# EAGLE design Arduino Shield (EAGLE 6.5.0)
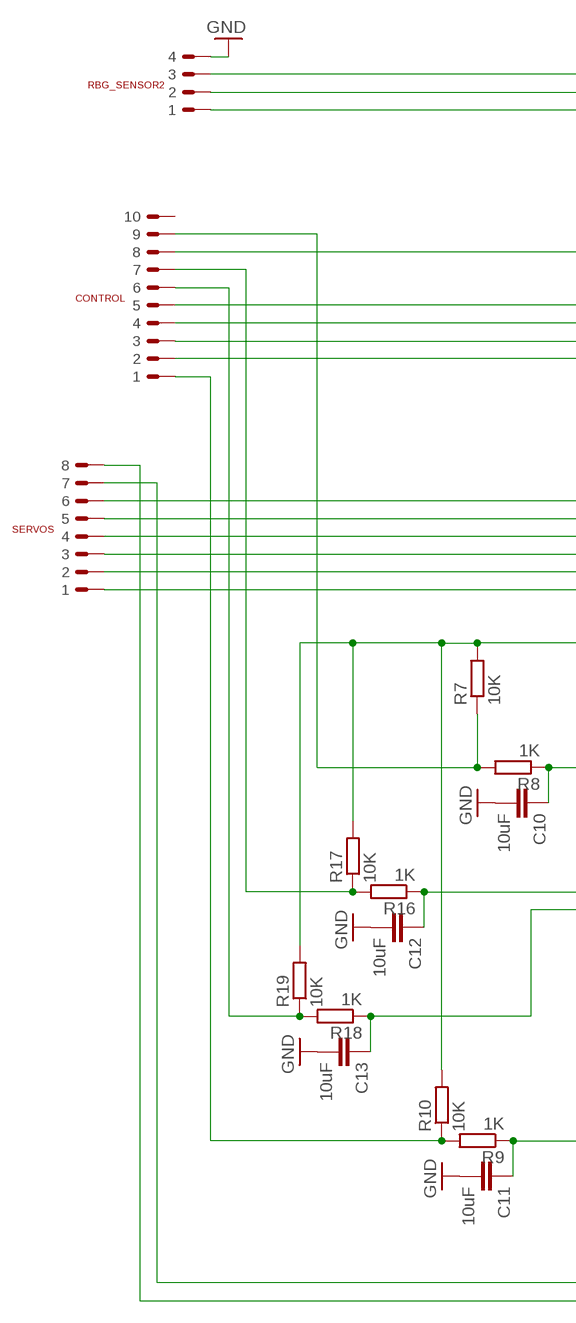
[diagram p0: schematic, sheet 1, part 1 of 2]
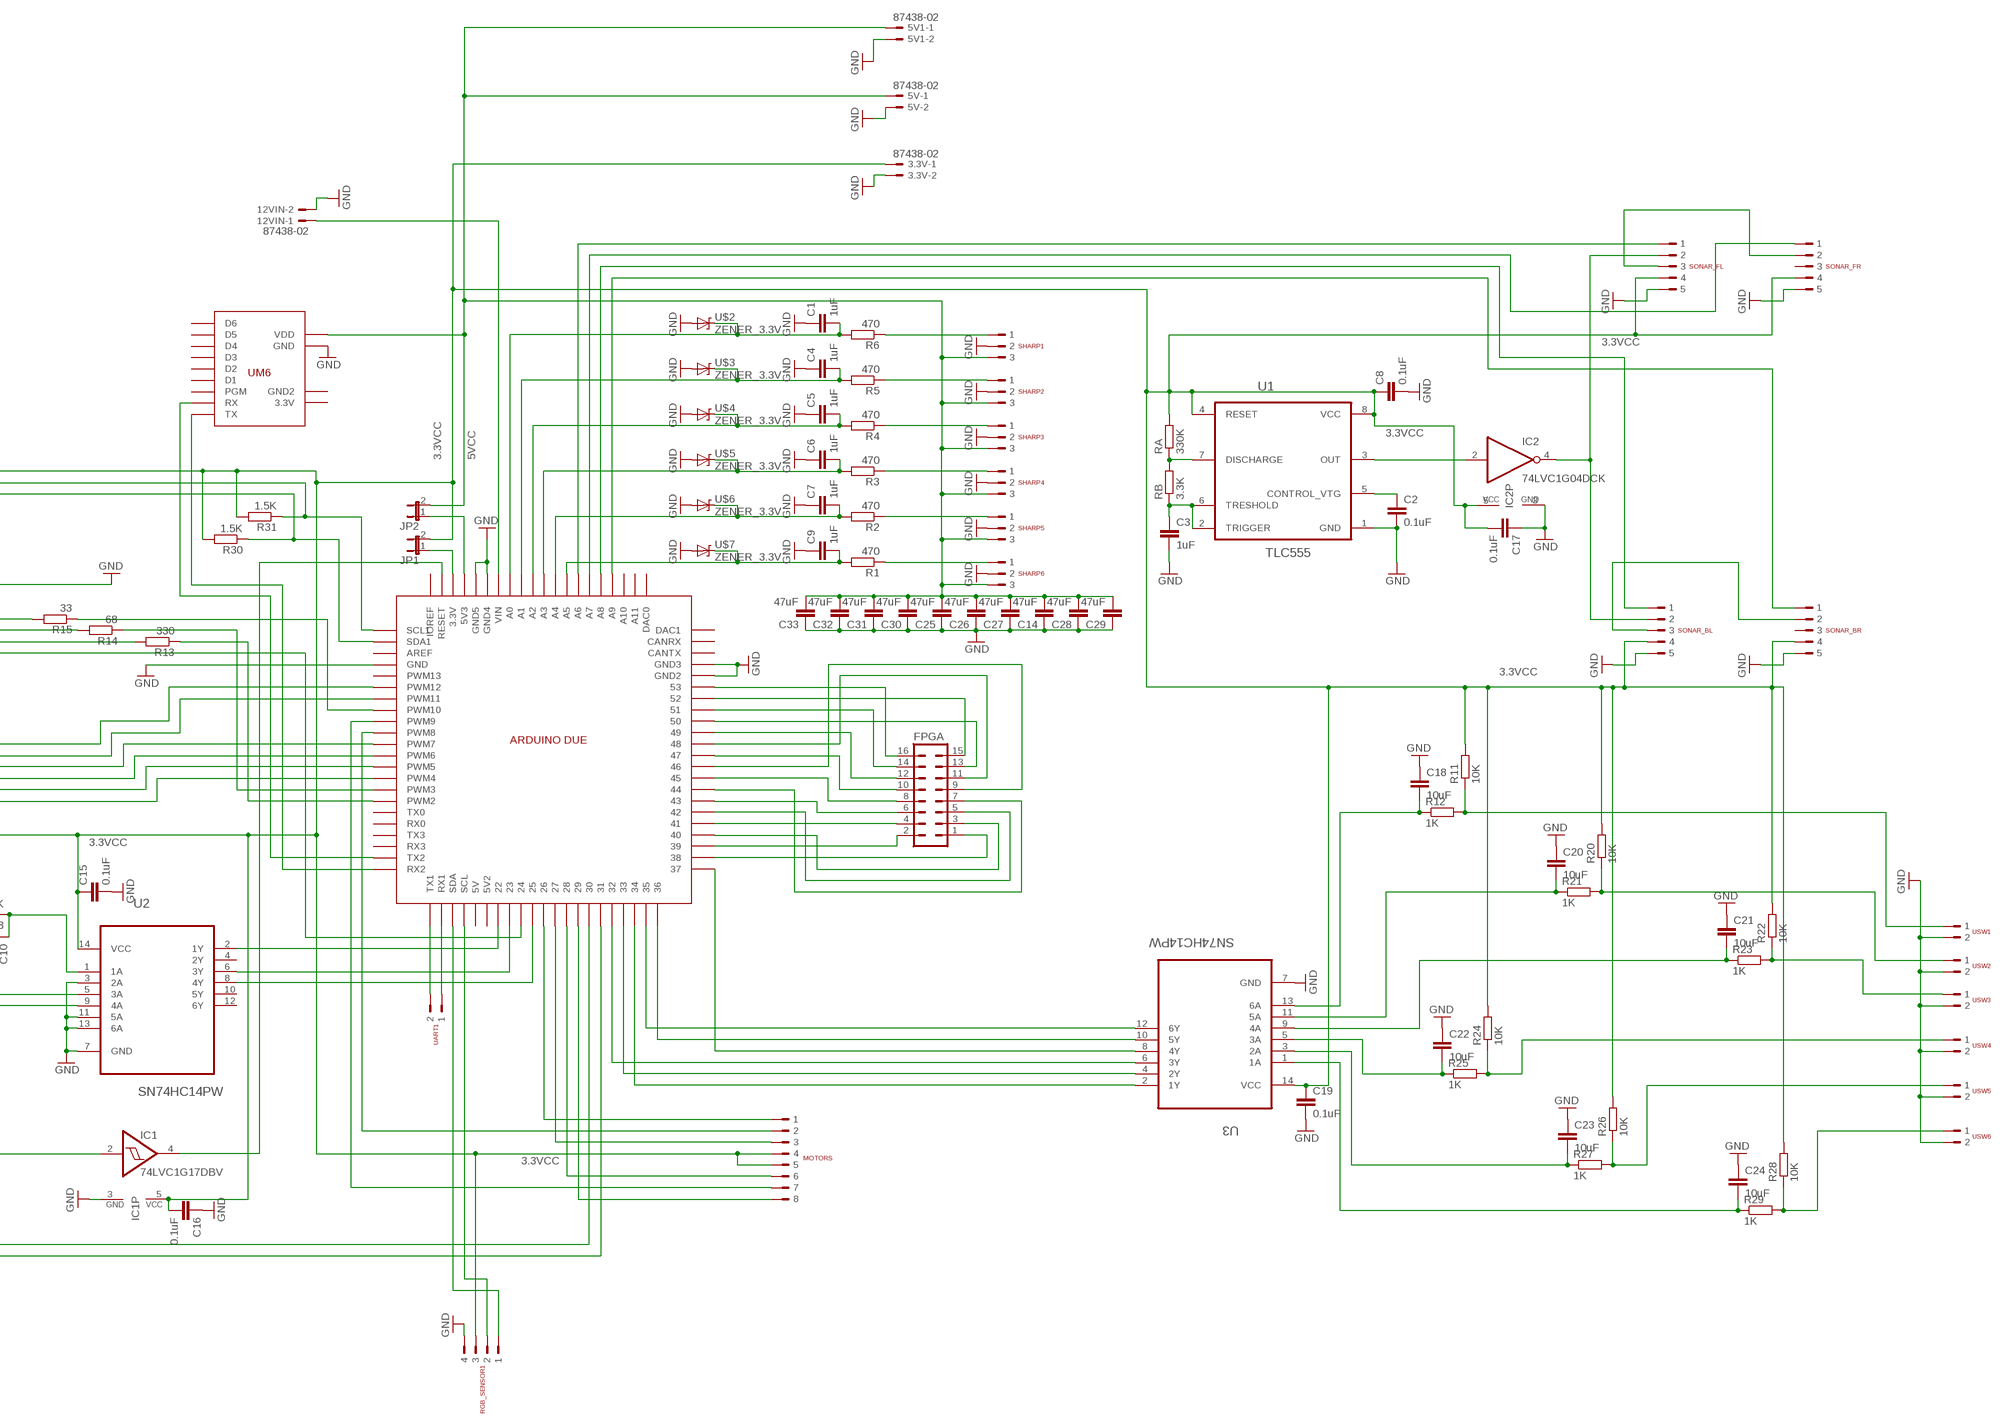
[diagram p1: schematic, sheet 1, part 2 of 2]

## Parts
3.3V  87438-02  [87438-02]
5V  87438-02  [87438-02]
5V1  87438-02  [87438-02]
12VIN  87438-02  [87438-02]
C1  1uF  C-EUC0603  [C0603]
C2  0.1uF  C-EUC0603  [C0603]
C3  1uF  C-EUC0603  [C0603]
C4  1uF  C-EUC0603  [C0603]
C5  1uF  C-EUC0603  [C0603]
C6  1uF  C-EUC0603  [C0603]
C7  1uF  C-EUC0603  [C0603]
C8  0.1uF  C-EUC0603  [C0603]
C9  1uF  C-EUC0603  [C0603]
C10  10uF  C-EUC0603  [C0603]
C11  10uF  C-EUC0603  [C0603]
C12  10uF  C-EUC0603  [C0603]
C13  10uF  C-EUC0603  [C0603]
C14  47uF  C-EUC1206  [C1206]
C15  0.1uF  C-EUC0603  [C0603]
C16  0.1uF  C-EUC0603  [C0603]
C17  0.1uF  C-EUC0603  [C0603]
C18  10uF  C-EUC0603  [C0603]
C19  0.1uF  C-EUC0603  [C0603]
C20  10uF  C-EUC0603  [C0603]
C21  10uF  C-EUC0603  [C0603]
C22  10uF  C-EUC0603  [C0603]
C23  10uF  C-EUC0603  [C0603]
C24  10uF  C-EUC0603  [C0603]
C25  47uF  C-EUC1206  [C1206]
C26  47uF  C-EUC1206  [C1206]
C27  47uF  C-EUC1206  [C1206]
C28  47uF  C-EUC1206  [C1206]
C29  47uF  C-EUC1206  [C1206]
C30  47uF  C-EUC1206  [C1206]
C31  47uF  C-EUC1206  [C1206]
C32  47uF  C-EUC1206  [C1206]
C33  47uF  C-EUC1206  [C1206]
CONTROL  87437-1043  [87437-1043]
FPGA  ML16  [ML16]
IC1  74LVC1G17DBV  [SOT23-5]
IC2  74LVC1G04DCK  [SC70-5]
JP1  JP1E  [JP1]
JP2  JP1E  [JP1]
MOTORS  87437-0843  [87437-0843]
R1  470  R-EU_R0603  [R0603]
R2  470  R-EU_R0603  [R0603]
R3  470  R-EU_R0603  [R0603]
R4  470  R-EU_R0603  [R0603]
R5  470  R-EU_R0603  [R0603]
R6  470  R-EU_R0603  [R0603]
R7  10K  R-EU_R0603  [R0603]
R8  1K  R-EU_R0603  [R0603]
R9  1K  R-EU_R0603  [R0603]
R10  10K  R-EU_R0603  [R0603]
R11  10K  R-EU_R0603  [R0603]
R12  1K  R-EU_R0603  [R0603]
R13  330  R-EU_R0603  [R0603]
R14  68  R-EU_R0603  [R0603]
R15  33  R-EU_R0603  [R0603]
R16  1K  R-EU_R0603  [R0603]
R17  10K  R-EU_R0603  [R0603]
R18  1K  R-EU_R0603  [R0603]
R19  10K  R-EU_R0603  [R0603]
R20  10K  R-EU_R0603  [R0603]
R21  1K  R-EU_R0603  [R0603]
R22  10K  R-EU_R0603  [R0603]
R23  1K  R-EU_R0603  [R0603]
R24  10K  R-EU_R0603  [R0603]
R25  1K  R-EU_R0603  [R0603]
R26  10K  R-EU_R0603  [R0603]
R27  1K  R-EU_R0603  [R0603]
R28  10K  R-EU_R0603  [R0603]
R29  1K  R-EU_R0603  [R0603]
R30  1.5K  R-EU_R0603  [R0603]
R31  1.5K  R-EU_R0603  [R0603]
RA  330K  R-EU_R0603  [R0603]
RB  3.3K  R-EU_R0603  [R0603]
RBG_SENSOR2  87437-0443  [87437-0443]
RGB_SENSOR1  87437-0443  [87437-0443]
SERVOS  87437-0843  [87437-0843]
SHARP1  87437-0343  [87437-0343]
SHARP2  87437-0343  [87437-0343]
SHARP3  87437-0343  [87437-0343]
SHARP4  87437-0343  [87437-0343]
SHARP5  87437-0343  [87437-0343]
SHARP6  87437-0343  [87437-0343]
SONAR_BL  87437-0543  [87437-0543]
SONAR_BR  87437-0543  [87437-0543]
SONAR_FL  87437-0543  [87437-0543]
SONAR_FR  87437-0543  [87437-0543]
U1  TLC555  LM555CM  [SOIC127P600X175-8N]
U2  SN74HC14PW  [SOP65P640X120-14N]
U3  SN74HC14PW  [SOP65P640X120-14N]
U$1  ARDUINO-DUE  [ARDUINO-DUE]
U$2  ZENER_3.3V  DIODE-ZENER-BZT52  [SOD-323]
U$3  ZENER_3.3V  DIODE-ZENER-BZT52  [SOD-323]
U$4  ZENER_3.3V  DIODE-ZENER-BZT52  [SOD-323]
U$5  ZENER_3.3V  DIODE-ZENER-BZT52  [SOD-323]
U$6  ZENER_3.3V  DIODE-ZENER-BZT52  [SOD-323]
U$7  ZENER_3.3V  DIODE-ZENER-BZT52  [SOD-323]
UART1  87437-0243  [87437-0243]
UM6  UM6  [UM6]
USW1  87437-0243  [87437-0243]
USW2  87437-0243  [87437-0243]
USW3  87437-0243  [87437-0243]
USW4  87437-0243  [87437-0243]
USW5  87437-0243  [87437-0243]
USW6  87437-0243  [87437-0243]

## Nets
3.3VCC: 3.3V.1 C8.1 C15.1 C16.2 C17.2 C19.1 IC1.5(VCC) IC2.5(VCC) JP1.2 MOTORS.P$4 MOTORS.P$5 R7.2 R10.2 R11.2 R17.2 R19.2 R20.2 R22.2 R24.2 R26.2 R28.2 R30.2 R31.2 RA.2 RBG_SENSOR2.P$3 RGB_SENSOR1.P$3 SONAR_BL.P$4 SONAR_BR.P$4 SONAR_FL.P$4 SONAR_FR.P$4 U1.4(RESET) U1.8(VCC) U2.14(VCC) U3.14(VCC)
5VCC: 5V1.1 5V.1 C14.2 C25.2 C26.2 C27.2 C28.2 C29.2 C30.2 C31.2 C32.2 C33.2 JP2.2 SHARP1.P$3 SHARP2.P$3 SHARP3.P$3 SHARP4.P$3 SHARP5.P$3 SHARP6.P$3 UM6.P$10(VDD)
12VIN: 12VIN.1 U$1.VIN
BLUE: R15.1 U$1.PWM10
BTN1: U2.6(3Y) U$1.23
BTN2: U2.8(4Y) U$1.25
BUT1: CONTROL.P$7 R16.2 R17.1
BUT2: CONTROL.P$6 R18.2 R19.1
COLOR: CONTROL.P$2 U$1.24
GND: 3.3V.2 5V1.2 5V.2 12VIN.2 C1.1 C2.2 C3.2 C4.1 C5.1 C6.1 C7.1 C8.2 C9.1 C10.2 C11.2 C12.2 C13.2 C14.1 C15.2 C16.1 C17.1 C18.1 C19.2 C20.1 C21.1 C22.1 C23.1 C24.1 C25.1 C26.1 C27.1 C28.1 C29.1 C30.1 C31.1 C32.1 C33.1 CONTROL.P$8 IC1.3(GND) IC2.3(GND) RBG_SENSOR2.P$4 RGB_SENSOR1.P$4 SHARP1.P$2 SHARP2.P$2 SHARP3.P$2 SHARP4.P$2 SHARP5.P$2 SHARP6.P$2 SONAR_BL.P$5 SONAR_BR.P$5 SONAR_FL.P$5 SONAR_FR.P$5 U1.1(GND) U2.3(2A) U2.7(GND) U2.11(5A) U2.13(6A) U3.7(GND) U$1.GND U$1.GND2 U$1.GND3 U$1.GND4 U$1.GND5 U$2.2(A) U$3.2(A) U$4.2(A) U$5.2(A) U$6.2(A) U$7.2(A) UM6.P$11(GND) USW1.P$2 USW2.P$2 USW3.P$2 USW4.P$2 USW5.P$2 USW6.P$2
GREEN: R14.1 U$1.PWM3
JACK: U2.2(1Y) U$1.22
MOTOR1_BREAK: MOTORS.P$6 U$1.28
MOTOR1_DIR: MOTORS.P$7 U$1.PWM9
MOTOR1_PWM: MOTORS.P$8 U$1.29
MOTOR2_BREAK: MOTORS.P$1 U$1.26
MOTOR2_DIR: MOTORS.P$2 U$1.PWM8
MOTOR2_PWM: MOTORS.P$3 U$1.27
N$1: JP1.1 U$1.3.3V
N$2: C12.1 R16.1 U2.5(3A)
N$3: SERVOS.P$1 U$1.PWM4
N$4: SERVOS.P$2 U$1.PWM5
N$5: SERVOS.P$3 U$1.PWM6
N$6: SERVOS.P$4 U$1.PWM7
N$7: IC1.4(O) U$1.RESET
N$8: JP2.1 U$1.5V3
N$9: R11.1 R12.2 USW1.P$1
N$10: C18.2 R12.1 U3.13(6A)
N$11: C13.1 R18.1 U2.9(4A)
N$12: SERVOS.P$5 U$1.PWM11
N$13: SERVOS.P$6 U$1.PWM12
N$14: SERVOS.P$7 U$1.30
N$15: CONTROL.P$5 R15.2
N$16: CONTROL.P$4 R14.2
N$17: CONTROL.P$3 R13.2
N$18: SERVOS.P$8 U$1.31
N$19: R20.1 R21.2 USW2.P$1
N$20: C20.2 R21.1 U3.11(5A)
N$21: R22.1 R23.2 USW3.P$1
N$22: C21.2 R23.1 U3.9(4A)
N$23: R24.1 R25.2 USW4.P$1
N$24: C22.2 R25.1 U3.5(3A)
N$25: R26.1 R27.2 USW5.P$1
N$26: C23.2 R27.1 U3.3(2A)
N$27: CONTROL.P$9 R7.1 R8.2
N$28: R28.1 R29.2 USW6.P$1
N$29: C24.2 R29.1 U3.1(1A)
N$33: C3.1 RB.1 U1.2(TRIGGER) U1.6(TRESHOLD)
N$34: C2.1 U1.5(CONTROL_VTG)
N$35: RA.1 RB.2 U1.7(DISCHARGE)
N$36: IC2.2(I) U1.3(OUT)
N$39: SONAR_FL.P$3 SONAR_FR.P$2
N$40: SONAR_BL.P$3 SONAR_BR.P$2
N$44: FPGA.1 U$1.38
N$45: IC2.4(O) SONAR_BL.P$2 SONAR_FL.P$2
N$47: FPGA.2 U$1.39
N$48: FPGA.3 U$1.40
N$49: FPGA.4 U$1.41
N$50: FPGA.5 U$1.42
N$51: FPGA.6 U$1.43
N$52: FPGA.7 U$1.44
N$53: FPGA.8 U$1.45
N$54: FPGA.9 U$1.46
N$55: FPGA.10 U$1.47
N$56: FPGA.11 U$1.48
N$57: FPGA.12 U$1.49
N$58: FPGA.13 U$1.50
N$59: FPGA.14 U$1.51
N$60: FPGA.15 U$1.52
N$61: FPGA.16 U$1.53
N$62: R5.1 SHARP2.P$1
N$63: R4.1 SHARP3.P$1
N$64: R3.1 SHARP4.P$1
N$65: R2.1 SHARP5.P$1
N$66: R1.1 SHARP6.P$1
N$67: C10.1 R8.1 U2.1(1A)
N$69: R6.1 SHARP1.P$1
N$71: C11.1 IC1.2(I) R9.1
RED: R13.1 U$1.PWM2
RST: CONTROL.P$1 R9.2 R10.1
RX1: U$1.RX1 UART1.P$1
SCL: RGB_SENSOR1.P$2 U$1.SCL
SCL1: R31.1 RBG_SENSOR2.P$2 U$1.SCL1
SDA: RGB_SENSOR1.P$1 U$1.SDA
SDA1: R30.1 RBG_SENSOR2.P$1 U$1.SDA1
SHARP1: C1.2 R6.2 U$1.A0 U$2.1(C)
SHARP2: C4.2 R5.2 U$1.A1 U$3.1(C)
SHARP3: C5.2 R4.2 U$1.A2 U$4.1(C)
SHARP4: C6.2 R3.2 U$1.A3 U$5.1(C)
SHARP5: C7.2 R2.2 U$1.A4 U$6.1(C)
SHARP6: C9.2 R1.2 U$1.A5 U$7.1(C)
SONAR_BL: SONAR_BL.P$1 U$1.A8
SONAR_BR: SONAR_BR.P$1 U$1.A9
SONAR_FL: SONAR_FL.P$1 U$1.A6
SONAR_FR: SONAR_FR.P$1 U$1.A7
TX1: U$1.TX1 UART1.P$2
UM6_RX: U$1.TX2 UM6.P$2(RX)
UM6_TX: U$1.RX2 UM6.P$1(TX)
USW1: U3.2(1Y) U$1.34
USW2: U3.4(2Y) U$1.33
USW3: U3.6(3Y) U$1.32
USW4: U3.8(4Y) U$1.37
USW5: U3.10(5Y) U$1.36
USW6: U3.12(6Y) U$1.35
Unconnected: CONTROL.P$10 SONAR_BR.P$3 SONAR_FR.P$3 U2.4(2Y) U2.10(5Y) U2.12(6Y) U$1.5V U$1.5V2 U$1.A10 U$1.A11 U$1.AREF U$1.CANRX U$1.CANTX U$1.DAC0 U$1.DAC1 U$1.IOREF U$1.PWM13 U$1.RX0 U$1.RX3 U$1.TX0 U$1.TX3 UM6.P$3(PGM) UM6.P$4(D1) UM6.P$5(D2) UM6.P$6(D3) UM6.P$7(D4) UM6.P$8(D5) UM6.P$9(D6) UM6.P$12(GND2) UM6.P$13(3.3V)

## Library data of the parts
3.3V 5V 5V1 12VIN = con-molex:87438-02: Wire-to-Board 1.50mm (.059") Pitch Header - Right Angle, SMT, Shrouded Source: http://www.molex.com/product/micro/87438.html; OC_FARNELL: 1711327; OC_NEWARK: unknown
C1-C33 = rcl:C-EU: CAPACITOR, European symbol
CONTROL = custom:87437-1043
FPGA = con-harting-ml:ML16: HARTING; OC_FARNELL: unknown; OC_NEWARK: unknown
IC1 = 74xx-little-de:74*1G17: Single Schmitt-Trigger Buffer
IC2 = 74xx-little-us:74*1G04: INVERTER Gate
JP1 JP2 = jumper:JP1E: JUMPER
MOTORS SERVOS = custom:87437-0843
R1-R31 RA RB = rcl:R-EU_: RESISTOR, European symbol
RBG_SENSOR2 RGB_SENSOR1 = custom:87437-0443
SHARP1-SHARP6 = custom:87437-0343
SONAR_BL SONAR_BR SONAR_FL SONAR_FR = custom:87437-0543
U1 = custom:LM555CM: Single Timer; MPN: LM555CM; OC_FARNELL: 9488227; OC_NEWARK: 78K6011; PACKAGE: SOIC-8; SUPPLIER: LM555CM
U2 U3 = custom:SN74HC14PW: HEX SCHMITT-TRIGGER INVERTERS; MPN: SN74HC14PW; OC_FARNELL: 9591133; OC_NEWARK: 02H5414; PACKAGE: TSSOP-14; SUPPLIER: Texas Instruments
U$1 = custom:ARDUINO-DUE
U$2-U$7 = SparkFun:DIODE-ZENER: Zener Diode Production Part - 8199 3.4V Zener Voltage
UART1 USW1-USW6 = custom:87437-0243
UM6 = custom:UM6

## Board
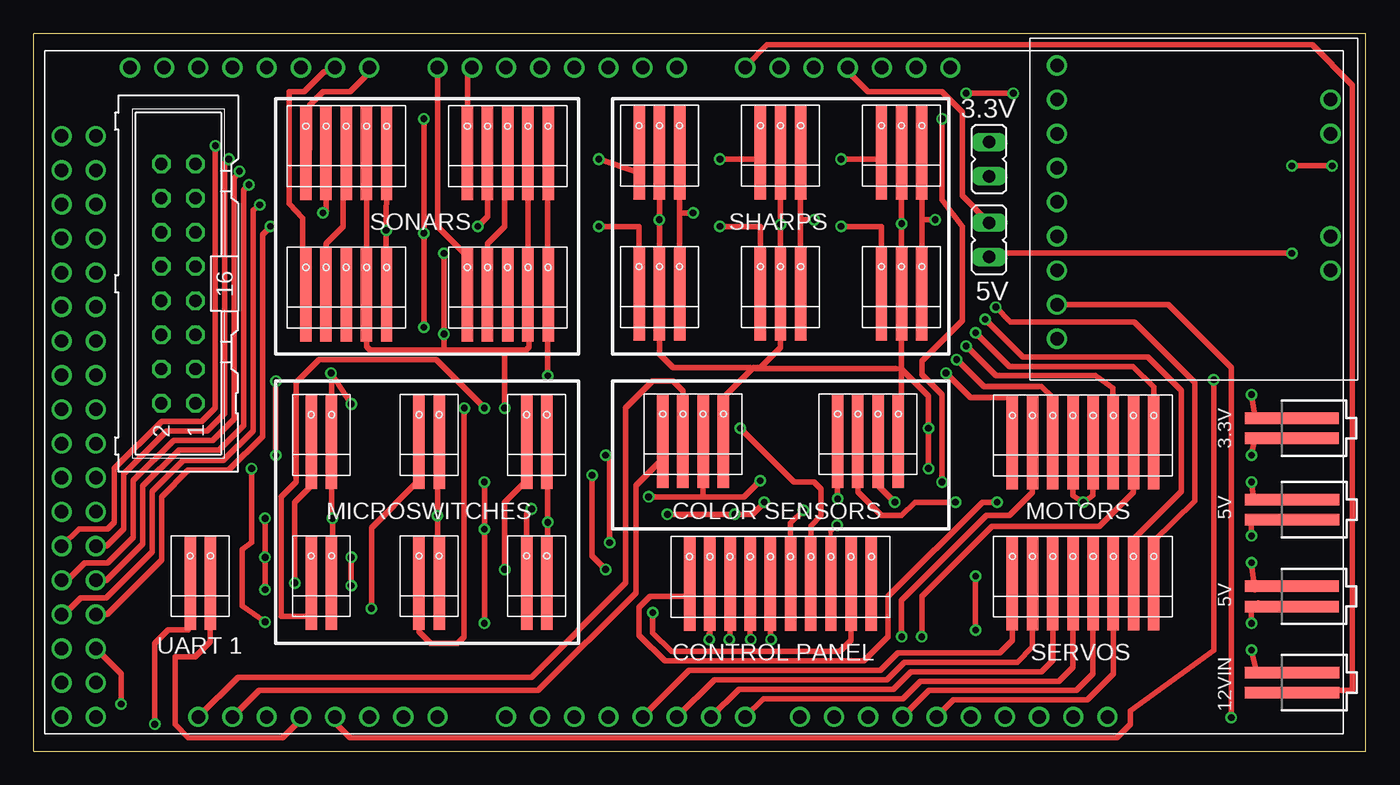
[diagram p2: board, top side]
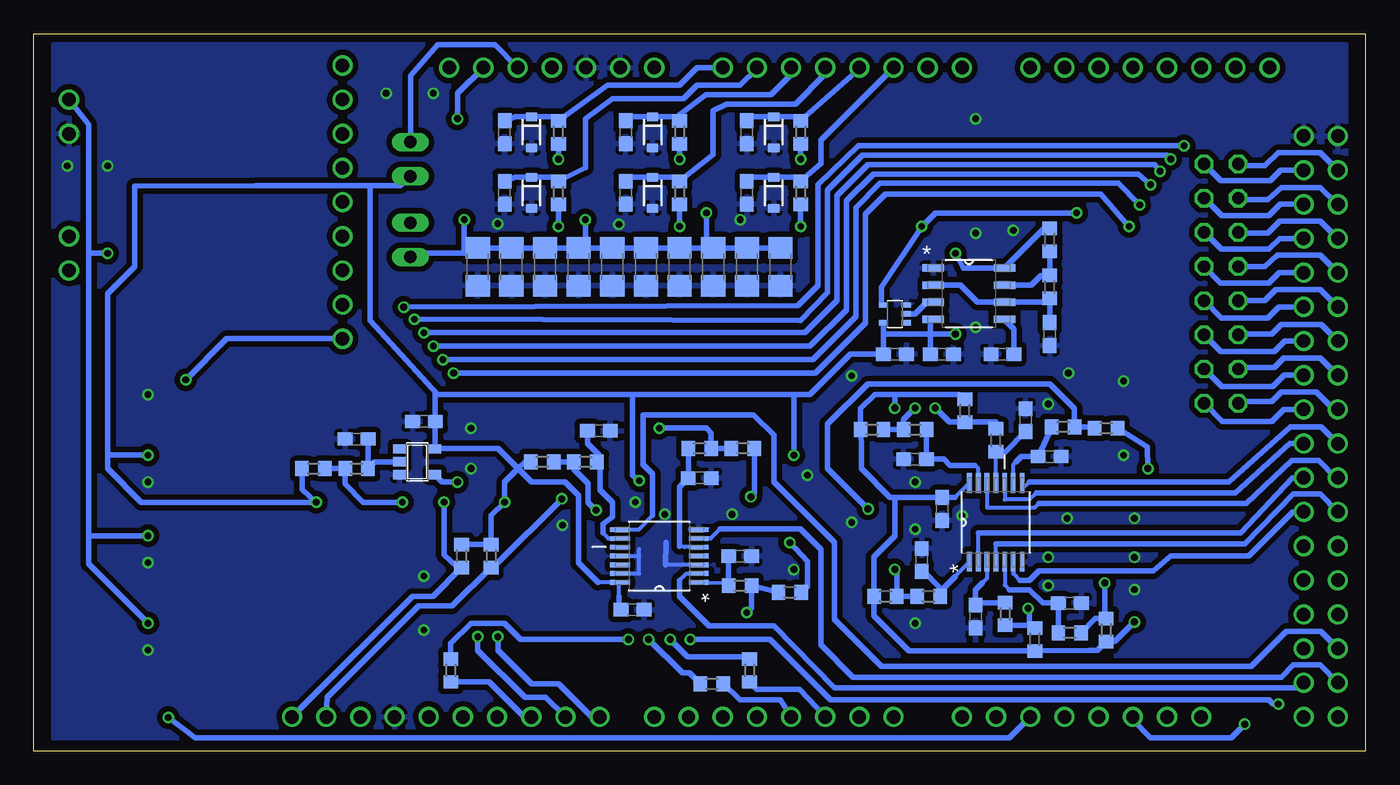
[diagram p3: board, bottom side, seen from below]

Size 99 x 53.33 mm. Coordinates in mm from the lower left corner, seen from the top.
Outline: 0,0 99,0 99,53.33 0,53.33 0,0
Copper layers (1*16): Top 0.0356mm / dielectric 1.5011mm / Bottom 0.0356mm
Design rules "Custom *": minimum track width 12mil, minimum drill 19mil, track to track 10mil, track to pad 8mil, pad to pad 9mil, via to via 10mil, smd to smd 6mil, copper to edge 16mil, drill to drill 16mil, minimum pad ring 7mil, minimum via ring 7mil, stop-mask expansion 4mil, vias tented up to drill 0mil, thermal gap 10mil

### Footprints (pad centres in the part's own frame; a part is rotated, then mirrored left to right if it is on the bottom)
87438-02 = smd 7 x 0.85: 1 0,0.75; 2 0,-0.75
C0603 = smd 1.1 x 1: 1 -0.85,0; 2 0.85,0
C1206 = smd 1.6 x 1.8: 1 -1.4,0; 2 1.4,0
87437-1043 = smd 7 x 0.85: P$1 -0.05,6.75; P$2 -0.05,5.25; P$3 -0.05,3.75; P$4 -0.05,2.25; P$5 -0.05,0.75; P$6 -0.05,-0.75; P$7 -0.05,-2.25; P$8 -0.05,-3.75; P$9 -0.05,-5.25; P$10 -0.05,-6.75
ML16 = drill 0.914 octagon: 1 -8.89,-1.27; 2 -8.89,1.27; 3 -6.35,-1.27; 4 -6.35,1.27; 5 -3.81,-1.27; 6 -3.81,1.27; 7 -1.27,-1.27; 8 -1.27,1.27; 9 1.27,-1.27; 10 1.27,1.27; 11 3.81,-1.27; 12 3.81,1.27; 13 6.35,-1.27; 14 6.35,1.27; 15 8.89,-1.27; 16 8.89,1.27
SOT23-5 = smd 0.69 x 0.99: 1 -0.95,-1.29; 2 0,-1.29; 3 0.95,-1.29; 4 0.95,1.3; 5 -0.95,1.3
SC70-5 = smd 0.4 x 0.7: 1 -0.65,-0.85; 2 0,-0.85; 3 0.65,-0.85; 4 0.65,0.85; 5 -0.65,0.85
JP1 = drill 0.914 long: 1 0,-1.27; 2 0,1.27
87437-0843 = smd 7 x 0.85: P$1 -0.04,5.27; P$2 -0.04,3.77; P$3 -0.04,2.27; P$4 -0.04,0.77; P$5 -0.04,-0.73; P$6 -0.04,-2.23; P$7 -0.04,-3.73; P$8 -0.04,-5.23
R0603 = smd 1 x 1.1: 1 -0.85,0; 2 0.85,0
87437-0443 = smd 7 x 0.85: P$1 0.05,2.25; P$2 0.05,0.75; P$3 0.05,-0.75; P$4 0.05,-2.25
87437-0343 = smd 7 x 0.85: P$1 0,1.5; P$2 0,0; P$3 0,-1.5
87437-0543 = smd 7 x 0.85: P$1 -0.04,2.77; P$2 -0.04,1.27; P$3 -0.04,-0.23; P$4 -0.04,-1.73; P$5 -0.04,-3.23
SOIC127P600X175-8N = smd 1.6 x 0.559: 1 -2.642,1.905; 2 -2.642,0.635; 3 -2.642,-0.635; 4 -2.642,-1.905; 5 2.642,-1.905; 6 2.642,-0.635; 7 2.642,0.635; 8 2.642,1.905
SOP65P640X120-14N = smd 1.473 x 0.356: 1 -2.921,1.956; 2 -2.921,1.295; 3 -2.921,0.66; 4 -2.921,0; 5 -2.921,-0.66; 6 -2.921,-1.295; 7 -2.921,-1.956; 8 2.921,-1.956; 9 2.921,-1.295; 10 2.921,-0.66; 11 2.921,0; 12 2.921,0.66; 13 2.921,1.295; 14 2.921,1.956
ARDUINO-DUE = drill 1: 3.3V -17.78,-25.4; 5V 40.64,22.86; 5V2 43.18,22.86; 5V3 -15.24,-25.4; 22 40.64,20.32; 23 43.18,20.32; 24 40.64,17.78; 25 43.18,17.78; 26 40.64,15.24; 27 43.18,15.24; 28 40.64,12.7; 29 43.18,12.7; 30 40.64,10.16; 31 43.18,10.16; 32 40.64,7.62; 33 43.18,7.62; 34 40.64,5.08; 35 43.18,5.08; 36 40.64,2.54; 37 43.18,2.54; 38 40.64,0; 39 43.18,0; 40 40.64,-2.54; 41 43.18,-2.54; 42 40.64,-5.08; 43 43.18,-5.08; 44 40.64,-7.62; 45 43.18,-7.62; 46 40.64,-10.16; 47 43.18,-10.16; 48 40.64,-12.7; 49 43.18,-12.7; 50 40.64,-15.24; 51 43.18,-15.24; 52 40.64,-17.78; 53 43.18,-17.78; A0 -2.54,-25.4; A1 0,-25.4; A2 2.54,-25.4; A3 5.08,-25.4; A4 7.62,-25.4; A5 10.16,-25.4; A6 12.7,-25.4; A7 15.24,-25.4; A8 20.32,-25.4; A9 22.86,-25.4; A10 25.4,-25.4; A11 27.94,-25.4; AREF -29.464,22.86; CANRX 35.56,-25.4; CANTX 38.1,-25.4; DAC0 30.48,-25.4; DAC1 33.02,-25.4; GND -26.924,22.86; GND2 40.64,-20.32; GND3 43.18,-20.32; GND4 -10.16,-25.4; GND5 -12.7,-25.4; IOREF -22.86,-25.4; PWM2 5.08,22.86; PWM3 2.54,22.86; PWM4 0,22.86; PWM5 -2.54,22.86; PWM6 -5.08,22.86; PWM7 -7.62,22.86; PWM8 -11.684,22.86; PWM9 -14.224,22.86; PWM10 -16.764,22.86; PWM11 -19.304,22.86; PWM12 -21.844,22.86; PWM13 -24.384,22.86; RESET -20.32,-25.4; RX0 10.16,22.86; RX1 27.94,22.86; RX2 22.86,22.86; RX3 17.78,22.86; SCL 33.02,22.86; SCL1 -34.544,22.86; SDA 30.48,22.86; SDA1 -32.004,22.86; TX0 7.62,22.86; TX1 25.4,22.86; TX2 20.32,22.86; TX3 15.24,22.86; VIN -7.62,-25.4
SOD-323 = smd 0.63 x 0.83: 1 -1.15,0; 2 1.15,0
87437-0243 = smd 7 x 0.85: P$1 0,0.865; P$2 0,-0.635
UM6 = drill 1: P$1 9.652,9.652; P$2 9.652,7.112; P$3 9.652,4.572; P$4 9.652,2.032; P$5 9.652,-0.508; P$6 9.652,-3.048; P$7 9.652,-5.588; P$8 9.652,-8.128; P$9 9.652,-10.668; P$10 -10.668,-8.128; P$11 -10.668,-5.588; P$12 -10.668,2.032; P$13 -10.668,4.572

### Placement (x,y rotation side)
3.3V  93.5,24 180 top
5V  93.52,17.94 180 top
5V1  93.5,11.5 180 top
12VIN  93.52,5.09 180 top
C1  64,46 90 bottom
C2  27,29.5 180 bottom
C3  23.5,31 270 bottom
C4  64,41.5 90 bottom
C5  55,46 90 bottom
C6  55,41.5 90 bottom
C7  46,46 90 bottom
C8  31.5,29.5 0 bottom
C9  46,41.5 90 bottom
C10  46.5,14.5 0 bottom
C11  75,23.2 180 bottom
C12  49.5,20.3 0 bottom
C13  57,23.8 0 bottom
C14  53.5,36 90 bottom
C15  54.5,10.5 0 bottom
C16  70,24.5 0 bottom
C17  35,29.5 180 bottom
C18  33.5,21.7 0 bottom
C19  31.5,18 270 bottom
C20  25.3,24.6 270 bottom
C21  23.5,21.9 180 bottom
C22  22,11 180 bottom
C23  29,10 90 bottom
C24  33,14.2 270 bottom
C25  46,36 90 bottom
C26  51,36 90 bottom
C27  48.5,36 90 bottom
C28  56,36 90 bottom
C29  58.5,36 90 bottom
C30  61,36 90 bottom
C31  63.5,36 90 bottom
C32  66,36 90 bottom
C33  43.5,36 90 bottom
CONTROL  55.5,12.5 90 top
FPGA  10.75,34.75 90 top
IC1  70.5,21.5 270 bottom
IC2  35,32.5 90 bottom
JP1  71,44 180 top
JP2  71,38 180 top
MOTORS  78,23 90 top
R1  42,41.5 90 bottom
R2  42,46 90 bottom
R3  51,41.5 90 bottom
R4  51,46 90 bottom
R5  60,41.5 90 bottom
R6  60,46 90 bottom
R7  42.8,11.8 0 bottom
R8  46.5,12.3 0 bottom
R9  75,21 180 bottom
R10  78.2,21 180 bottom
R11  36.7,23.9 180 bottom
R12  33.5,23.9 180 bottom
R13  45.8,6 90 bottom
R14  48.6,5 180 bottom
R15  68,6 90 bottom
R16  49.5,22.5 0 bottom
R17  46.3,22.5 0 bottom
R18  58,21.5 180 bottom
R19  61.2,21.5 180 bottom
R20  29.8,25.3 90 bottom
R21  27.5,23.1 90 bottom
R22  19.3,24 0 bottom
R23  22.5,24.1 0 bottom
R24  19.3,9 270 bottom
R25  22,8.8 0 bottom
R26  24.6,8.3 270 bottom
R27  26.8,10.2 270 bottom
R28  35.7,11.5 180 bottom
R29  32.5,11.5 180 bottom
R30  65,14.5 90 bottom
R31  67.2,14.5 90 bottom
RA  23.5,38 90 bottom
RB  23.5,34.5 90 bottom
RBG_SENSOR2  62,23 90 top
RGB_SENSOR1  49,23 90 top
SERVOS  78,12.5 90 top
SHARP1  64.5,44.5 90 top
SHARP2  64.5,34 90 top
SHARP3  55.5,44.5 90 top
SHARP4  55.5,34 90 top
SHARP5  46.5,44.5 90 top
SHARP6  46.5,34 90 top
SONAR_BL  23,44.5 90 top
SONAR_BR  23,34 90 top
SONAR_FL  35,44.5 90 top
SONAR_FR  35,34 90 top
U1  29.5,34 0 bottom
U2  52.5,14.5 180 bottom
U3  27.5,17 90 bottom
U$1  45.26,25.4 180 top
U$2  62,46 270 bottom
U$3  62,41.5 270 bottom
U$4  53,46 270 bottom
U$5  53,41.5 270 bottom
U$6  44,46 270 bottom
U$7  44,41.5 270 bottom
UART1  12.5,12.5 90 top
UM6  85.7,40.3 180 top
USW1  21.5,12.5 90 top
USW2  29.5,12.5 90 top
USW3  37.5,12.5 90 top
USW4  21.5,23 90 top
USW5  29.5,23 90 top
USW6  37.5,23 90 top

### Tracks (layer width: path | path; a pad name or v marks a point on that pad's centre or on a via)
3.3VCC  (via drill 0.5)
  Top 0.406: v90.5,22 90.75,23.25 3.3V.1 | SONAR_FL.P$4 SONAR_FR.P$4 36.8,30.03 36.6,29.8 35,29.8 | SONAR_BL.P$4 SONAR_BR.P$4 24.73,30.07 25,29.8 30.5,29.8 | 30.5,29.8 35,29.8 | v30.5,37 v30.5,31 30.5,29.8 | v16.2,21 16.2,15.5 15.5,15 15.5,10.8 v17.2,9.6 | v35,25.5 35,29.8 | MOTORS.P$5 78.73,19 v78,18.5 77.23,19 MOTORS.P$4 | RBG_SENSOR2.P$3 62.75,19.75 v64,18.5 | RGB_SENSOR1.P$3 49.75,19.25 49.7,18.9 | 49.7,18.9 v45.7,18.9 | 49.7,18.9 52.8,18.9 v54,20.1 | v42.8,15.5 42.8,21.7 v42.5,22
  Bottom 0.305: U3.14 30.53,18.85 | 55.5,11.5 55.5,12.46 U2.14 57.04,12.54
  Bottom 0.406: JP1.2 71.73,42.05 74,42.05 | 74,42.05 82.5,42.05 91.5,42 91.5,36 93.5,34 93.5,22 | 93.5,22 v90.5,22 | RA.2 23.91,38.85 U1.8 29.91,35.91 v30.5,37 | C8.1 32.35,31 | U1.4 32.35,31.89 32.35,31 | IC2.5 35.85,31 | 35.85,31 C17.2 38.3,29.5 41.3,26.5 42.5,26.5 | 32.35,31 35.85,31 | 42.5,26.5 54.5,26.5 | 54.5,26.5 66.5,26.5 | 66.5,26.5 69,26.5 74,32 74,42.05 | v30.5,31 32.35,31 | R31.2 R30.2 65,17.5 v64,18.5 64,20 63,21 | 30.53,18.85 C19.1 35,18.85 | 35,18.85 35.35,18.85 37.5,21 37.5,22.85 R11.2 37.55,25.45 36.5,26.5 35,26.5 | 35,18.85 35,16 36.55,14.45 R28.2 36.55,10.05 33.95,7.45 R26.2 20.5,7.5 19.95,7.5 R24.2 18.65,8.15 v17.2,9.6 | R22.2 16.25,22.6 v16.2,21 | 35,26.5 v35,25.5 | 93.5,22 93.5,21 91,18.5 v78,18.5 79.05,19.45 R10.2 | 69.15,22.5 C16.2 69.15,26.55 66.5,26.5 | 57.04,12.54 58.5,14 58.5,19 59.5,20 62,20 63,21 | 63,21 64.5,22.5 69.15,22.5 | 69.15,22.5 IC1.5 | R19.2 62.5,21.5 63,21 | R20.2 30.25,26.5 35,26.5 | 45.45,22.45 R17.2 45.45,19.15 v45.7,18.9 | 54.5,26.5 54.5,20.5 v54,20.1 | R7.2 41.5,12.2 41.5,14.1 v42.8,15.5 | v42.5,22 42.5,26.5 | C15.1 55.5,10.65 55.5,11.5
5VCC  (via drill 0.5)
  Top 0.406: 48,40 SHARP5.P$3 | SHARP1.P$3 66,39.5 | 57,39.5 SHARP3.P$3 | SHARP6.P$3 48,40 | 48,40 v49,40 | SHARP4.P$3 57,39.5 | 57,39.5 v58,39.5 | SHARP2.P$3 66,39.5 | 66,39.5 v67,39.5 | JP2.2 71.27,37 v93.5,37 | 5V1.1 91,11 90.5,10.5 v90.5,9.5 | 91,17 5V.1 90.5,17.19 v90.5,16
  Bottom 0.406: C33.2 C25.2 C27.2 49,37.4 | 49,37.4 C26.2 C14.2 C28.2 58,37.4 | 49,37.4 v49,40 | v58,39.5 58,37.4 | 58,37.4 C29.2 C30.2 C31.2 C32.2 67,37.4 | v67,39.5 67,37.4 | 67,37.4 67,37 70.73,37 JP2.2 | UM6.P$10 94.91,46.57 94.91,37 | v90.5,9.5 94.91,13.91 94.91,16 | 94.91,16 94.91,37 | v90.5,16 94.91,16 | v93.5,37 94.91,37
12VIN
  Top 0.406: U$1.VIN 52.88,50.88 54.5,52.5 95,52.5 98,49.5 98,4.5 93.36,4.5 12VIN.1
BLUE
  Bottom 0.406: U$1.PWM10 62.54,2.54 65.15,5.15 R15.1
BTN1
  Bottom 0.305: 48,16.5 48.7,15.79 U2.6
  Bottom 0.406: U$1.23 3.4,6.4 5.4,6.4 6.3,5.5 38.1,5.5 40.5,7.9 40.5,15 42,16.5 48,16.5
BTN2
  Bottom 0.305: 53,17.5 54.04,16.46 U2.8
  Bottom 0.406: U$1.25 3.36,8.9 5.9,8.9 8.5,6.3 36,6.3 39.5,9.8 39.5,15.5 44,20 44,23.5 45.5,25 53.7,25 53.7,21.3 53,20.6 53,17.5
BUT1  (via drill 0.5)
  Top 0.406: CONTROL.P$7 57.75,16.75 58.5,17.5 58.5,19.5 58,20 56.5,20 v52.5,24
  Bottom 0.406: R17.1 R16.2 48.65,23.65 49,24 v52.5,24
BUT2  (via drill 0.5)
  Top 0.406: v57.2,17.9 56.25,16.95 CONTROL.P$6
  Bottom 0.406: R19.1 R18.2 58.85,20.95 57.8,19.9 57.8,18.5 v57.2,17.9
COLOR  (via drill 0.5)
  Top 0.406: CONTROL.P$2 50.25,8.75 50.2,8.7 v50.2,8.3 | v6.5,3.5 6.5,5.74 U$1.24
  Bottom 0.406: v50.2,8.3 44.3,8.3 39.8,3.8 7.2,3.8 6.9,3.5 v6.5,3.5
GND  (via drill 0.5)
  Top 0.305: v59.7,16.8 59.2,16.3 59.2,12.5 CONTROL.P$8
  Top 0.406: SHARP5.P$2 v46.5,39.5 SHARP6.P$2 46.5,29.5 47.5,28.5 53.25,28.5 53.3,28.45 | SHARP3.P$2 v55.5,39.15 SHARP4.P$2 55.5,30 54,28.5 53.5,28.5 53.25,28.25 | SHARP1.P$2 v64.5,39.2 SHARP2.P$2 64.5,28.4 | 12VIN.2 90.86,6 v90.5,7.5 | 5V1.2 90.75,12 v90.5,14 | 5V.2 90.71,18.5 v90.5,20 | 3.3V.2 90.75,25 v90.5,26.5 | SONAR_BL.P$5 26.23,42.5 v26.2,38.7 SONAR_BR.P$5 | RGB_SENSOR1.P$4 51,23.3 51.5,26.5 53.25,28.25 | RBG_SENSOR2.P$4 64,23.3 64.5,26.5 64.5,28.4 | SONAR_FL.P$5 38.2,39.2 SONAR_FR.P$5 v38.2,27.9 | v17.2,12 v17.2,14.4 v17.2,17.3 | v96.5,43.5 v93.5,43.5 | 64.5,28.4 64.05,28.45 53.3,28.45 | 53.3,28.45 53.25,28.25 | v42.5,13.5 41.5,14.5 v41.5,20.5 | USW3.P$2 38.2,12.56 v38.2,17 38.2,22.93 USW6.P$2 | USW2.P$2 30,12.63 v30,17.5 30,22.86 USW5.P$2 | USW1.P$2 22.2,12.56 v22.2,17.3 22.14,17.36 USW4.P$2 22.14,27.6 v22.1,28.1 v23.6,25.8 | v18,22 v18,27.5 | v29,47 v29,38.5 v29,31.5 | v33.5,20 v33.5,16.5 v33.5,9.5 | v66.5,21 v66.5,24 66.5,26.4 64.5,28.4 | v72.8,48.9 v69.3,48.9 | v47.1,17.6 v52.1,17.6 53.4,17.6 v54.3,18.5 | v70,9 v70,13 | v23.6,12.3 v23.6,14.4
  Bottom 0.305: U2.3 52.04,13.84 | U2.13 53.99,13.21 54,15 | U2.11 54,14.5
  Bottom 0.406: 52.04,13.84 52,15.5
  pour Bottom (isolate 0.406): 1.5,52.5 1.5,1 97.5,1 97.5,52.5
GREEN
  Bottom 0.406: U$1.PWM3 43.5,3.82 46.5,3.8 R14.1
JACK
  Bottom 0.305: 51,12.7 50.49,13.21 U2.2
  Bottom 0.406: U$1.22 4.9,4.7 39.5,4.7 44,9.3 48.8,9.3 51,11.5 51,12.7
MOTOR1_BREAK  (via drill 0.5)
  Top 0.406: MOTORS.P$6 80.2,26.9 80.2,27 78.9,27.9 71.5,27.9 v69.3,30.1 | U$1.28 5.4,12.7 8.1,15.4 8.1,19.7 10.8,22.4 13.8,22.4 15.6,24.2 15.6,41.7 v16,42.1
  Bottom 0.406: v69.3,30.1 41.3,30.1 38.6,32.8 38.6,40.9 36.6,42.9 16.9,42.9 v16,42.1
MOTOR1_DIR  (via drill 0.5)
  Top 0.406: MOTORS.P$7 81.73,19.23 79.2,16.7 71.2,16.7 66,11.5 v66,8.5
  Bottom 0.406: v66,8.5 66,7.5 62.5,4 60.94,4 U$1.PWM9
MOTOR1_PWM  (via drill 0.5)
  Top 0.406: MOTORS.P$8 83.23,27.07 81.7,28.6 72.5,28.6 v70,31.1 | v15.3,43.1 14.9,42.6 14.9,24.7 13.3,23.1 10.4,23.1 7.4,20.1 7.4,15.9 5.5,14 3.8,14 2.5,12.7 U$1.29
  Bottom 0.406: v70,31.1 41.7,31.1 39.3,33.5 39.3,41.3 37,43.6 15.7,43.6 v15.3,43.1
MOTOR2_BREAK  (via drill 0.5)
  Top 0.406: MOTORS.P$1 72.73,26.27 69.6,26.3 v67.8,28.1 | U$1.26 5.46,10.16 9.5,14.2 9.5,18.9 11.5,20.9 14.5,20.9 17,23.4 17,38.4 v17.6,39
  Bottom 0.406: v67.8,28.1 40.9,28.1 37.2,31.8 37.2,39.9 35.7,41.4 19.7,41.4 v17.6,39
MOTOR2_DIR  (via drill 0.5)
  Top 0.406: v64.5,8.5 64.5,11.2 70.8,17.5 72.5,17.5 74.23,19.23 MOTORS.P$2
  Bottom 0.406: U$1.PWM8 57.54,2.54 60,5 62,5 64.5,7.5 v64.5,8.5
MOTOR2_PWM  (via drill 0.5)
  Top 0.406: MOTORS.P$3 75.73,26.27 74.9,27.1 70.6,27.1 v68.6,29.1 | U$1.27 2.26,10.16 3.5,11.4 5.4,11.4 8.8,14.8 8.8,19.3 11.1,21.6 14.1,21.6 16.3,23.8 16.3,40.2 v16.8,40.6
  Bottom 0.406: v68.6,29.1 41.1,29.1 37.9,32.3 37.9,40.4 36.1,42.2 18.4,42.2 v16.8,40.6
N$1
  Bottom 0.406: U$1.3.3V 64.7,52.5 69,52.5 71,50.2 JP1.1
N$2
  Bottom 0.305: U2.5 50.66,15.16 51,15.2
  Bottom 0.406: 51,15.2 51,19.65 C12.1 R16.1
N$3
  Top 0.406: U$1.PWM4 48.7,6 62.92,6 64.22,7.3 71.8,7.3 72.73,8.23 SERVOS.P$1
N$4
  Top 0.406: U$1.PWM5 50.6,5.3 63.4,5.3 64.7,6.6 73.1,6.6 74.23,7.73 SERVOS.P$2
N$5
  Top 0.406: U$1.PWM6 52.4,4.6 63.9,4.6 65.2,5.9 74.9,5.9 75.73,6.73 SERVOS.P$3
N$6
  Top 0.406: U$1.PWM7 54.24,3.9 64.6,3.9 65.9,5.2 76.2,5.2 77.23,6.23 SERVOS.P$4
N$7  (via drill 0.5)
  Top 0.406: v67.5,47 67.5,41 69,39 69,32 66,29 66,28 67.5,26.5 v67.5,20
  Bottom 0.406: U$1.RESET 67.48,48.92 v67.5,47 | IC1.4 68.65,20 v67.5,20
N$8
  Top 0.406: U$1.5V3 60.5,50.5 62,49 67.5,49 69,47.5 69,41.27 JP2.1
N$9  (via drill 0.5)
  Top 0.406: USW1.P$1 20.64,11.13 20.5,10 18.4,10 18.4,18.9 19.5,20 19.5,27.4 21.2,29.1 29.9,29.1 v33.5,25.5
  Bottom 0.406: R11.1 R12.2 34.35,24.65 v33.5,25.5
N$10
  Bottom 0.305: U3.13 28.8,21 29.05,21.25
  Bottom 0.406: R12.1 C18.2 31.35,21.7 30.9,21.25 29.05,21.25
N$11
  Bottom 0.305: U2.9 56.3,15.79 56.7,16.2
  Bottom 0.406: 56.7,16.2 56.7,16.9 56,17.4 56,18.5 56.9,19.4 56.9,21.25 R18.1 57,22 57.85,22.85 C13.1
N$12
  Top 0.406: U$1.PWM11 66.52,4.5 77.5,4.5 78.73,5.73 SERVOS.P$5
N$13
  Top 0.406: U$1.PWM12 68.36,3.8 78.3,3.8 80.23,5.73 SERVOS.P$6
N$14  (via drill 0.5)
  Top 0.406: SERVOS.P$7 81.73,15.73 85.3,19.3 85.3,26.8 82.8,29.3 73.5,29.3 v70.7,32.1 | v14.5,44 14.2,43.7 14.2,25.1 12.9,23.8 9.9,23.8 6.7,20.6 6.7,16.5 5.44,15.24 U$1.30
  Bottom 0.406: v70.7,32.1 42,32 40,34.1 40,41.7 37.4,44.3 14.8,44.3 v14.5,44
N$15  (via drill 0.5)
  Top 0.406: CONTROL.P$5 54.75,8.25 v54.8,8.3
  Bottom 0.406: R15.2 68,8 66.5,9.5 64,9.5 62.8,8.3 v54.8,8.3
N$16  (via drill 0.5)
  Top 0.406: v53.3,8.3 53.25,8.25 CONTROL.P$4
  Bottom 0.406: R14.2 50.25,5.8 50.8,5.8 v53.3,8.3
N$17  (via drill 0.5)
  Top 0.406: v51.7,8.3 51.75,8.75 CONTROL.P$3
  Bottom 0.406: R13.2 46.15,7 50.4,7 v51.7,8.3
N$18  (via drill 0.5)
  Top 0.406: U$1.31 3.4,16.5 5.5,16.5 6,17 6,21 9.5,24.5 12.5,24.5 13.5,25.5 v13.5,45 | SERVOS.P$8 83.2,15.6 86.3,18.6 86.3,27.4 81.8,31.9 72.6,31.9 v71.5,33
  Bottom 0.406: v13.5,45 37.7,45 40.7,42.1 40.7,34.6 42.2,33.1 v71.5,33
N$19  (via drill 0.5)
  Top 0.406: USW2.P$1 28.64,8.87 29.5,8 31.5,8 32,8.5 v32,25.5
  Bottom 0.406: R21.2 27.5,24.45 R20.1 30.95,24.45 v32,25.5
N$20
  Bottom 0.305: U3.11 R21.1
  Bottom 0.406: R21.1 26.8,22.25 C20.2
N$21  (via drill 0.5)
  Top 0.406: v37,18 36.63,17.64 USW3.P$1
  Bottom 0.406: R22.1 20.8,24.1 R23.2 21.65,25.45 23.5,27.3 37,27.3 40,24.3 40,21 v37,18
N$22
  Bottom 0.305: U3.9 26.2,21.3 26,21.5
  Bottom 0.406: R23.1 C21.2 25.6,21.9 26,21.5
N$23  (via drill 0.5)
  Top 0.406: v19.4,12.5 19.4,18.5 20.64,19.7 USW4.P$1
  Bottom 0.406: R25.2 20.1,9.85 R24.1 19.4,9.95 v19.4,12.5
N$24
  Bottom 0.305: U3.5 26.84,12.34 26.5,12
  Bottom 0.406: 26.5,12 25,12 24,11 C22.2 R25.1
N$25  (via drill 0.5)
  Top 0.406: v25.1,10.6 25.1,16.6 28.5,20 28.5,22.86 USW5.P$1
  Bottom 0.406: R26.1 24.9,9.45 25,9.35 | 25,9.35 R27.2 | v25.1,10.6 25,10.5 25,9.35
N$26
  Bottom 0.305: U3.3 28.16,12.84 28.5,12.5
  Bottom 0.406: R27.1 26.95,11 28.5,11 C23.2 29,12 28.5,12.5
N$27  (via drill 0.5)
  Top 0.406: v46,10.3 46,8.8 47.4,7.4 59.9,7.4 60.75,8.25 CONTROL.P$9
  Bottom 0.406: R7.1 R8.2 45.65,10.65 v46,10.3
N$28  (via drill 0.5)
  Top 0.406: v35,13.5 35,18.5 36.5,20 36.5,22.86 USW6.P$1
  Bottom 0.406: R29.2 R28.1 34.85,13.35 v35,13.5
N$29
  Bottom 0.305: U3.1 30.5,13.04 30.5,13
  Bottom 0.406: C24.2 33,13.5 31.65,12.15 R29.1 31.65,11.85 30.5,13
N$33
  Bottom 0.406: C3.1 RB.1 23.79,33.37 U1.6 28.86,33.37 30.14,34.63 U1.2
N$34
  Bottom 0.406: U1.5 26.15,31.39 C2.1
N$35
  Bottom 0.406: RA.1 RB.2 24.15,35.35 24.86,34.63 U1.7
N$36
  Bottom 0.406: U1.3 32.63,33.37 33.5,32.5 IC2.2
N$39
  Top 0.406: SONAR_FL.P$3 35,44.23 35,39 33.73,37.73 SONAR_FR.P$2
N$40
  Top 0.406: SONAR_BL.P$3 23,44.23 23,39 21.73,37.73 SONAR_BR.P$2
N$44
  Bottom 0.406: U$1.38 6.1,25.4 7,24.5 10.66,24.5 FPGA.1
N$45  (via drill 0.5)
  Top 0.406: SONAR_FL.P$2 33.73,39.73 v33,39 | SONAR_BL.P$2 21.73,40.23 v21.5,40
  Bottom 0.406: IC2.4 36,33.3 36,34.5 v33,39 32,40 v21.5,40
N$47
  Bottom 0.406: U$1.39 2.4,25.4 3.7,26.7 6.3,26.7 7,26 9.34,26 FPGA.2
N$48
  Bottom 0.406: U$1.40 6.06,27.94 6.9,27.1 10.72,27.1 FPGA.3
N$49
  Bottom 0.406: U$1.41 2.14,27.94 3.4,29.2 6.1,29.2 6.8,28.5 9.38,28.5 FPGA.4
N$50
  Bottom 0.406: U$1.42 6.02,30.48 6.8,29.7 10.78,29.7 FPGA.5
N$51
  Bottom 0.406: U$1.43 3.3,31.7 6.3,31.7 7,31 9.42,31 FPGA.6
N$52
  Bottom 0.406: U$1.44 6.48,33.02 7.3,32.2 10.74,32.2 FPGA.7
N$53
  Bottom 0.406: U$1.45 2.18,33.08 3.4,34.3 6.7,34.3 7.5,33.5 9.46,33.5 FPGA.8
N$54
  Bottom 0.406: U$1.46 6.44,35.56 7.2,34.8 10.8,34.8 FPGA.9
N$55
  Bottom 0.406: U$1.47 2.08,35.58 3.4,36.85 6.6,36.85 7.5,36 9.46,36 FPGA.10
N$56
  Bottom 0.406: U$1.48 6.4,38.1 7.2,37.3 10.76,37.3 FPGA.11
N$57
  Bottom 0.406: U$1.49 2.1,38.1 3.4,39.4 6.4,39.4 7.3,38.5 9.42,38.5 FPGA.12
N$58
  Bottom 0.406: U$1.50 6.36,40.64 7.2,39.8 10.72,39.8 FPGA.13
N$59
  Bottom 0.406: U$1.51 2.14,40.64 3.4,41.9 6.3,41.9 7.3,41 9.38,41 FPGA.14
N$60
  Bottom 0.406: U$1.52 6.32,43.18 7.1,42.4 10.78,42.4 FPGA.15
N$61
  Bottom 0.406: U$1.53 3.4,44.5 6.5,44.5 7.5,43.5 9.34,43.5 FPGA.16
N$62  (via drill 0.5)
  Top 0.406: v60,39 63,39 SHARP2.P$1
  Bottom 0.406: R5.1 v60,39
N$63  (via drill 0.5)
  Top 0.406: v51,44 54,44 SHARP3.P$1
  Bottom 0.406: R4.1 v51,44
N$64  (via drill 0.5)
  Top 0.406: v51,39 54,39 SHARP4.P$1
  Bottom 0.406: R3.1 v51,39
N$65  (via drill 0.5)
  Top 0.406: v42,44 45,43 SHARP5.P$1
  Bottom 0.406: R2.1 v42,44
N$66  (via drill 0.5)
  Top 0.406: v42,39 45,39 SHARP6.P$1
  Bottom 0.406: R1.1 v42,39
N$67
  Bottom 0.305: U2.1 48.94,12.54 47.4,12.5
  Bottom 0.406: 47.4,12.5 R8.1 C10.1
N$69  (via drill 0.5)
  Top 0.406: v60,44 63,44 SHARP1.P$1
  Bottom 0.406: R6.1 v60,44
N$71
  Bottom 0.406: IC1.2 73.65,21.5 R9.1 C11.1
RED
  Bottom 0.406: U$1.PWM2 42.1,4.6 45.3,4.6 R13.1
RST  (via drill 0.5)
  Top 0.406: v71.6,18.5 70.5,18.5 63.5,11.5 63.5,8.5 61.7,6.7 46.9,6.7 45,8.6 45,10.7 45.8,11.5 48.8,11.5 48.75,11.25 CONTROL.P$1
  Bottom 0.406: R10.1 R9.2 75.85,19.85 74.5,18.5 v71.6,18.5
RX1  (via drill 0.5)
  Top 0.406: UART1.P$1 11.5,12.37 11.5,9 10,9 9,8 v9,2
  Bottom 0.406: U$1.RX1 17.32,2.32 16,1 10,1 v9,2
SCL
  Top 0.406: RGB_SENSOR1.P$2 48.25,26.75 47.5,27.5 46,27.5 44,25.5 44,12.5 37,5.5 15.2,5.5 U$1.SCL
SCL1  (via drill 0.5)
  Top 0.406: v68.5,18.5 65.5,18.5 64.5,17.5 63,17.5 61.25,19.25 RBG_SENSOR2.P$2
  Bottom 0.406: U$1.SCL1 70.84,11.5 69.3,11.5 R31.1 67.55,13.7 68.5,14.6 v68.5,18.5
SDA
  Top 0.406: U$1.SDA 16.74,4.5 37.5,4.5 44.75,11.75 44.75,19.75 46.5,21.5 RGB_SENSOR1.P$1
SDA1  (via drill 0.5)
  Top 0.406: v59.75,18.75 RBG_SENSOR2.P$1
  Bottom 0.406: U$1.SDA1 77.2,4 70.4,10.8 67.9,10.8 R30.1 64.85,13.8 64.7,13.8 v59.75,18.75
SHARP1
  Bottom 0.406: C1.2 63.2,47.15 U$2.1 59.8,47.15 R6.2 56.35,49.5 51,49.5 49.7,50.8 U$1.A0
SHARP2
  Bottom 0.406: C4.2 63.2,42.65 U$3.1 59.8,42.65 R5.2 58,43.35 58,47 56,48.5 50.7,48.5 49.7,49.5 46.5,49.5 45.26,50.74 U$1.A1
SHARP3
  Bottom 0.406: C5.2 54.7,47.15 U$4.1 51.3,47.15 R4.2 51,47.3 49.05,48.8 44.2,48.8 42.72,50.28 U$1.A2
SHARP4
  Bottom 0.406: C6.2 54.7,42.65 U$5.1 51.3,42.65 R3.2 48.5,44.35 48.5,47.6 47.5,48.1 42.4,48.1 40.18,50.32 U$1.A3
SHARP5
  Bottom 0.406: C7.2 45.7,47.15 U$6.1 42.3,47.15 R2.2 37.64,50.71 U$1.A4
SHARP6
  Bottom 0.406: C9.2 45.7,42.65 U$7.1 42.3,42.65 R1.2 40.5,43.65 40.5,45.4 U$1.A5
SONAR_BL
  Top 0.406: U$1.A8 24.94,50.44 23.5,49 21.5,49 20.5,48 20.5,44.73 SONAR_BL.P$1
SONAR_BR
  Top 0.406: SONAR_BR.P$1 20,34.19 20,39.6 19,40.7 19,49 20.1,49 21.6,50.5 22,50.5 U$1.A9
SONAR_FL
  Top 0.406: U$1.A6 32.23,50.47 SONAR_FL.P$1
SONAR_FR
  Top 0.406: U$1.A7 30.02,38.98 32,37 32,34.19 SONAR_FR.P$1
TX1
  Top 0.406: U$1.TX1 19.86,2.36 18.5,1 11.5,1 10.5,2 10.5,7 12,7 13.13,8.13 UART1.P$2
UM6_RX  (via drill 0.5)
  Top 0.406: v89,2.5 89,28.5 84.31,33.19 UM6.P$2
  Bottom 0.406: U$1.TX2 26.48,1 87,1 v89,2.5
UM6_TX  (via drill 0.5)
  Top 0.406: U$1.RX2 22.4,2.1 23.5,1 80.5,1 81.5,2 81.5,3 87.7,7.5 v87.7,27.6
  Bottom 0.406: UM6.P$1 84.65,30.65 v87.7,27.6
USW1
  Bottom 0.305: U3.2 28.8,16.2
  Bottom 0.406: 28.8,16.2 9.3,16.2 5.48,20.32 U$1.34
USW2
  Bottom 0.305: U3.4 27.5,15.4
  Bottom 0.406: U$1.33 3.4,19.1 5.4,19.1 9,15.4 27.5,15.4
USW3
  Bottom 0.305: U3.6 26.2,13.2 25.7,12.7
  Bottom 0.406: 25.7,12.7 25,12.7 24.3,13.4 15.8,13.4 14.5,14.5 8.7,14.5 5.42,17.78 U$1.32
USW4
  Bottom 0.305: U3.8 25.54,19.5 25,20
  Bottom 0.406: U$1.37 3.32,24.1 5.6,24.1 10.2,20 25,20
USW5
  Bottom 0.305: U3.10 26.84,18.7 25,18.7 24.5,19.2
  Bottom 0.406: U$1.36 5.64,22.86 9.7,19.2 24.5,19.2
USW6
  Bottom 0.305: U3.12 28.16,18.1 24.6,18.1 24.3,18.4
  Bottom 0.406: 24.3,18.4 8.9,18.4 5.5,21.6 3.5,21.6 2.22,20.32 U$1.35

### Text on the board
tNames: 3.3V | SONARS | SHARPS | 5V | MICROSWITCHES | COLOR SENSORS | 5V | UART 1 | CONTROL PANEL